# EAGLE design interrupt_controller (EAGLE 5.11)
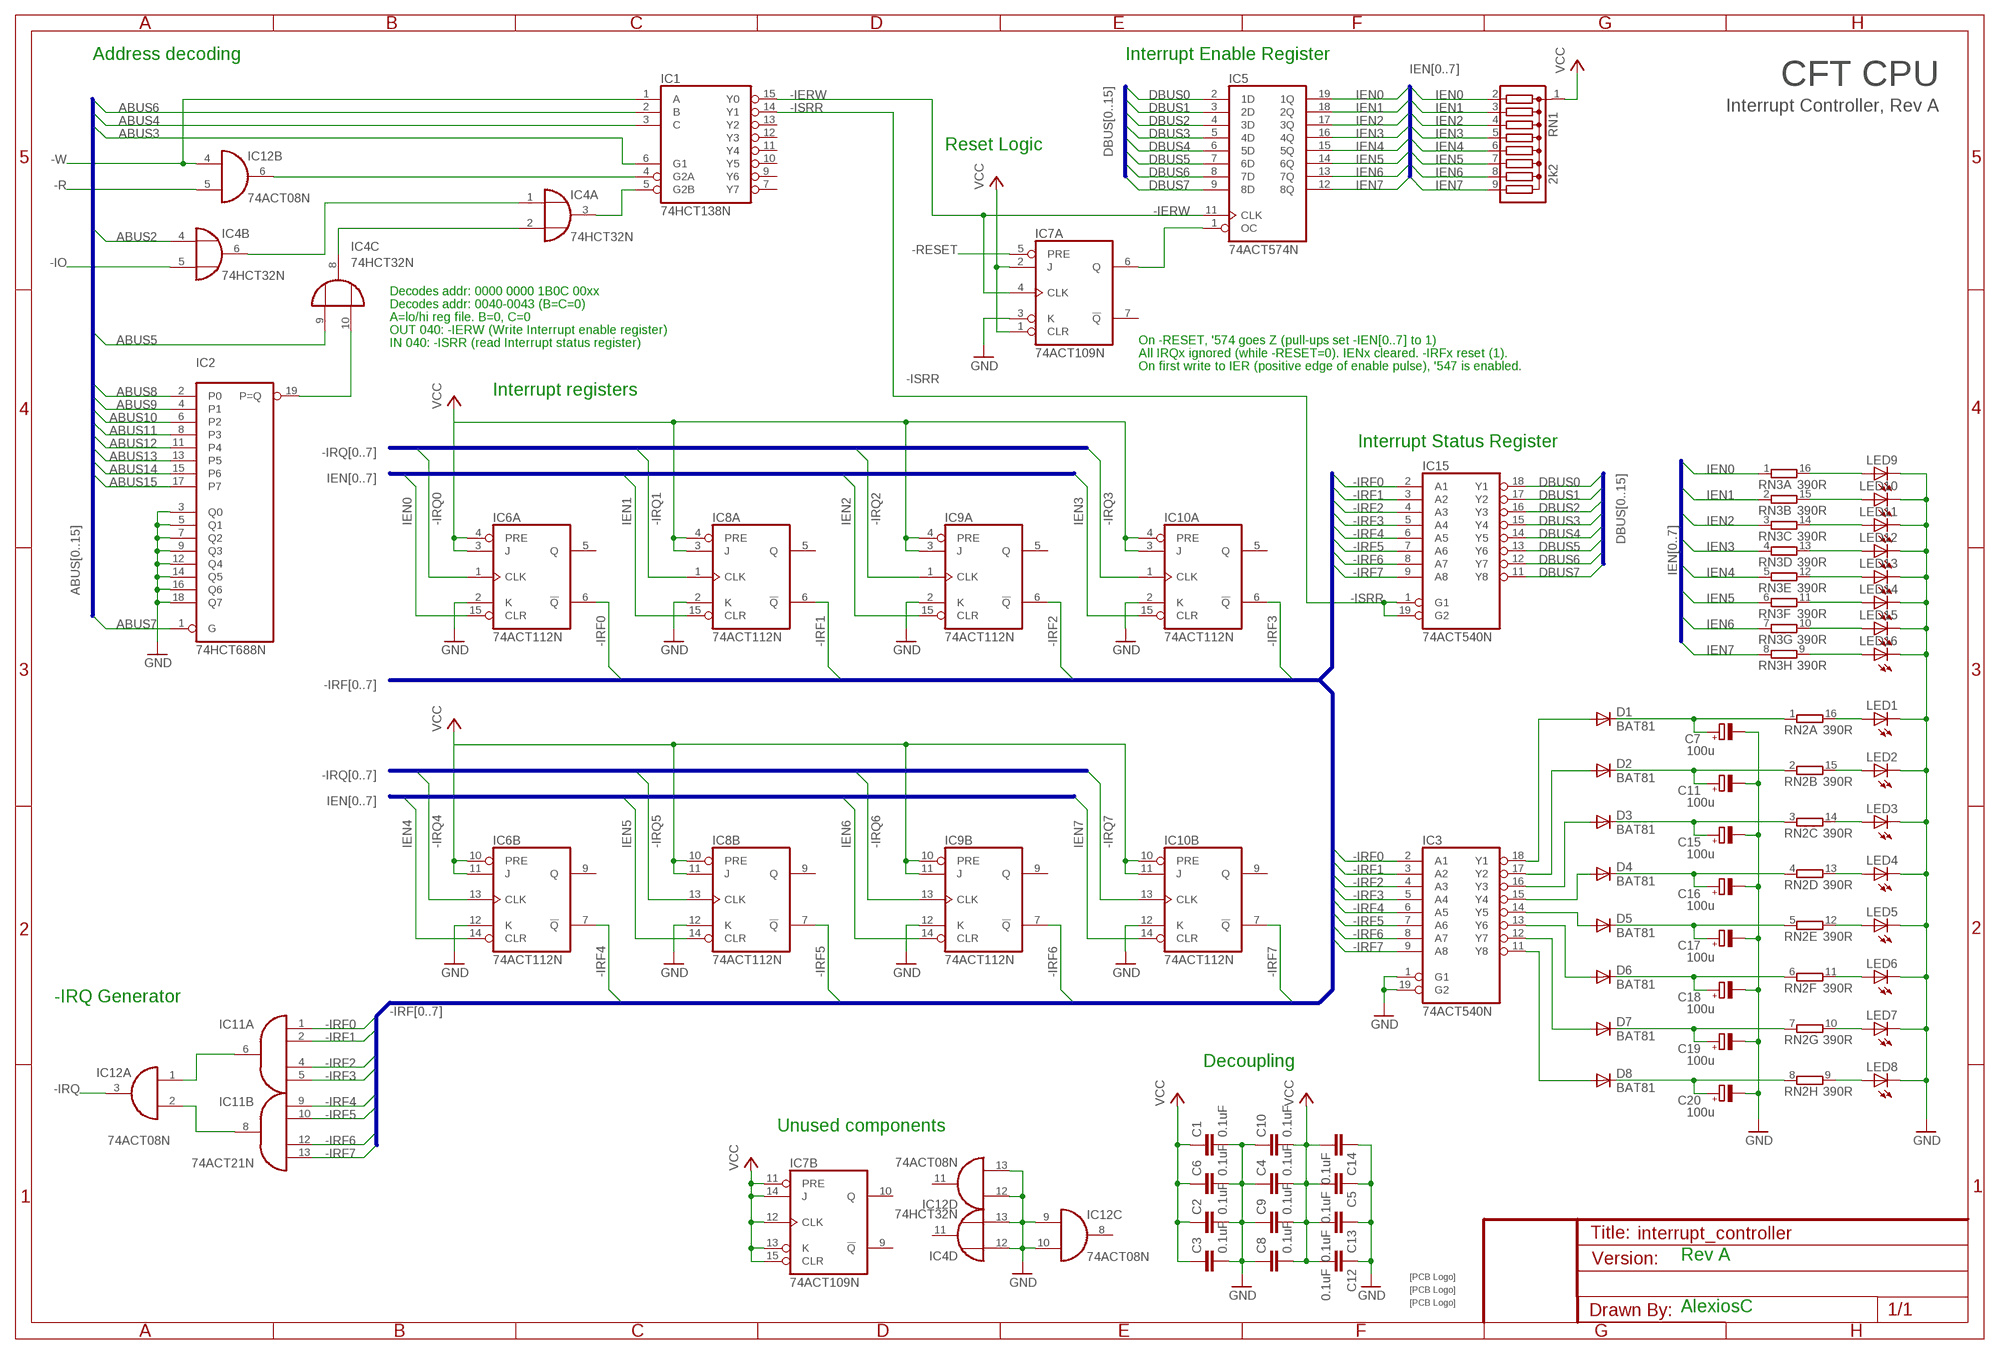
[diagram p0: schematic, sheet 1]

## Parts
C1  0.1uF  C-EU025-025X050  [C025-025X050]
C2  0.1uF  C-EU025-025X050  [C025-025X050]
C3  0.1uF  C-EU025-025X050  [C025-025X050]
C4  0.1uF  C-EU025-025X050  [C025-025X050]
C5  0.1uF  C-EU025-025X050  [C025-025X050]
C6  0.1uF  C-EU025-025X050  [C025-025X050]
C7  100u  CPOL-EUE1.8-4  [E1,8-4]
C8  0.1uF  C-EU025-025X050  [C025-025X050]
C9  0.1uF  C-EU025-025X050  [C025-025X050]
C10  0.1uF  C-EU025-025X050  [C025-025X050]
C11  100u  CPOL-EUE1.8-4  [E1,8-4]
C12  0.1uF  C-EU025-025X050  [C025-025X050]
C13  0.1uF  C-EU025-025X050  [C025-025X050]
C14  0.1uF  C-EU025-025X050  [C025-025X050]
C15  100u  CPOL-EUE1.8-4  [E1,8-4]
C16  100u  CPOL-EUE1.8-4  [E1,8-4]
C17  100u  CPOL-EUE1.8-4  [E1,8-4]
C18  100u  CPOL-EUE1.8-4  [E1,8-4]
C19  100u  CPOL-EUE1.8-4  [E1,8-4]
C20  100u  CPOL-EUE1.8-4  [E1,8-4]
D1  BAT81  [DO34-7]
D2  BAT81  [DO34-7]
D3  BAT81  [DO34-7]
D4  BAT81  [DO34-7]
D5  BAT81  [DO34-7]
D6  BAT81  [DO34-7]
D7  BAT81  [DO34-7]
D8  BAT81  [DO34-7]
IC1  74HCT138N  [DIL16]
IC2  74HCT688N  [DIL20]
IC3  74ACT540N  [DIL20]
IC4  74HCT32N  [DIL14]
IC5  74ACT574N  [DIL20]
IC6  74ACT112N  [DIL16]
IC7  74ACT109N  [DIL16]
IC8  74ACT112N  [DIL16]
IC9  74ACT112N  [DIL16]
IC10  74ACT112N  [DIL16]
IC11  74ACT21N  [DIL14]
IC12  74ACT08N  [DIL14]
IC15  74ACT540N  [DIL20]
LED1  LED3MM  [LED3MM]
LED2  LED3MM  [LED3MM]
LED3  LED3MM  [LED3MM]
LED4  LED3MM  [LED3MM]
LED5  LED3MM  [LED3MM]
LED6  LED3MM  [LED3MM]
LED7  LED3MM  [LED3MM]
LED8  LED3MM  [LED3MM]
LED9  LED3MM  [LED3MM]
LED10  LED3MM  [LED3MM]
LED11  LED3MM  [LED3MM]
LED12  LED3MM  [LED3MM]
LED13  LED3MM  [LED3MM]
LED14  LED3MM  [LED3MM]
LED15  LED3MM  [LED3MM]
LED16  LED3MM  [LED3MM]
RN1  2k2  G08R  [SIL9]
RN2  390R  8R-N  [DIL16]
RN3  390R  8R-N  [DIL16]
U$1  SIGNATUREPLANE  [SIGNATURE_PLANE]
U$2  SIGNATUREPLANE  [SIGNATURE_PLANE]
U$3  SIGNATURESILK  [SIGNATURE]

## Nets
-IERW: IC1.15(Y0) IC5.11(CLK) IC7.4(A:CLK)
-IO: IC4.5(B:I1)
-IRF0: IC3.2(A1) IC6.6(A:!Q) IC11.1(A:I0) IC15.2(A1)
-IRF1: IC3.3(A2) IC8.6(A:!Q) IC11.2(A:I1) IC15.3(A2)
-IRF2: IC3.4(A3) IC9.6(A:!Q) IC11.4(A:I2) IC15.4(A3)
-IRF3: IC3.5(A4) IC10.6(A:!Q) IC11.5(A:I3) IC15.5(A4)
-IRF4: IC3.6(A5) IC6.7(B:!Q) IC11.9(B:I0) IC15.6(A5)
-IRF5: IC3.7(A6) IC8.7(B:!Q) IC11.10(B:I1) IC15.7(A6)
-IRF6: IC3.8(A7) IC9.7(B:!Q) IC11.12(B:I2) IC15.8(A7)
-IRF7: IC3.9(A8) IC10.7(B:!Q) IC11.13(B:I3) IC15.9(A8)
-IRQ: IC12.3(A:O)
-IRQ0: IC6.1(A:CLK)
-IRQ1: IC8.1(A:CLK)
-IRQ2: IC9.1(A:CLK)
-IRQ3: IC10.1(A:CLK)
-IRQ4: IC6.13(B:CLK)
-IRQ5: IC8.13(B:CLK)
-IRQ6: IC9.13(B:CLK)
-IRQ7: IC10.13(B:CLK)
-ISRR: IC1.14(Y1) IC15.1(G1) IC15.19(G2)
-R: IC12.5(B:I1)
-RESET: IC7.5(A:PRE)
-W: IC1.1(A) IC12.4(B:I0)
ABUS2: IC4.4(B:I0)
ABUS3: IC1.6(G1)
ABUS4: IC1.3(C)
ABUS5: IC4.9(C:I0)
ABUS6: IC1.2(B)
ABUS7: IC2.1(G)
ABUS8: IC2.2(P0)
ABUS9: IC2.4(P1)
ABUS10: IC2.6(P2)
ABUS11: IC2.8(P3)
ABUS12: IC2.11(P4)
ABUS13: IC2.13(P5)
ABUS14: IC2.15(P6)
ABUS15: IC2.17(P7)
DBUS0: IC5.2(1D) IC15.18(Y1)
DBUS1: IC5.3(2D) IC15.17(Y2)
DBUS2: IC5.4(3D) IC15.16(Y3)
DBUS3: IC5.5(4D) IC15.15(Y4)
DBUS4: IC5.6(5D) IC15.14(Y5)
DBUS5: IC5.7(6D) IC15.13(Y6)
DBUS6: IC5.8(7D) IC15.12(Y7)
DBUS7: IC5.9(8D) IC15.11(Y8)
GND: C1.2 C2.2 C3.2 C4.1 C5.1 C6.2 C7.- C8.1 C9.1 C10.1 C11.- C12.1 C13.1 C14.1 C15.- C16.- C17.- C18.- C19.- C20.- IC2.3(Q0) IC2.5(Q1) IC2.7(Q2) IC2.9(Q3) IC2.12(Q4) IC2.14(Q5) IC2.16(Q6) IC2.18(Q7) IC3.1(G1) IC3.19(G2) IC4.12(D:I0) IC4.13(D:I1) IC6.2(A:K) IC6.12(B:K) IC7.3(A:K) IC8.2(A:K) IC8.12(B:K) IC9.2(A:K) IC9.12(B:K) IC10.2(A:K) IC10.12(B:K) IC12.9(C:I0) IC12.10(C:I1) IC12.12(D:I0) IC12.13(D:I1) LED1.K(C) LED2.K(C) LED3.K(C) LED4.K(C) LED5.K(C) LED6.K(C) LED7.K(C) LED8.K(C) LED9.K(C) LED10.K(C) LED11.K(C) LED12.K(C) LED13.K(C) LED14.K(C) LED15.K(C) LED16.K(C)
IEN0: IC5.19(1Q) IC6.15(A:CLR) RN1.2 RN3.1
IEN1: IC5.18(2Q) IC8.15(A:CLR) RN1.3 RN3.2
IEN2: IC5.17(3Q) IC9.15(A:CLR) RN1.4 RN3.3
IEN3: IC5.16(4Q) IC10.15(A:CLR) RN1.5 RN3.4
IEN4: IC5.15(5Q) IC6.14(B:CLR) RN1.6 RN3.5
IEN5: IC5.14(6Q) IC8.14(B:CLR) RN1.7 RN3.6
IEN6: IC5.13(7Q) IC9.14(B:CLR) RN1.8 RN3.7
IEN7: IC5.12(8Q) IC10.14(B:CLR) RN1.9 RN3.8
N$1: IC4.2(A:I1) IC4.8(C:O)
N$2: IC11.6(A:O) IC12.1(A:I0)
N$3: IC11.8(B:O) IC12.2(A:I1)
N$5: IC1.4(G2A) IC12.6(B:O)
N$6: IC2.19(P=Q) IC4.10(C:I1)
N$7: IC5.1(OC) IC7.6(A:Q)
N$8: IC4.1(A:I0) IC4.6(B:O)
N$9: D1.A IC3.18(Y1)
N$10: D2.A IC3.17(Y2)
N$11: D3.A IC3.16(Y3)
N$12: IC1.5(G2B) IC4.3(A:O)
N$13: D4.A IC3.15(Y4)
N$14: D5.A IC3.14(Y5)
N$15: D6.A IC3.13(Y6)
N$16: D7.A IC3.12(Y7)
N$17: D8.A IC3.11(Y8)
N$18: C7.+ D1.C RN2.1
N$19: C11.+ D2.C RN2.2
N$20: C15.+ D3.C RN2.3
N$21: C16.+ D4.C RN2.4
N$22: C17.+ D5.C RN2.5
N$23: C18.+ D6.C RN2.6
N$24: C19.+ D7.C RN2.7
N$25: C20.+ D8.C RN2.8
N$26: LED1.A RN2.16
N$27: LED2.A RN2.15
N$28: LED3.A RN2.14
N$29: LED4.A RN2.13
N$30: LED5.A RN2.12
N$31: LED6.A RN2.11
N$32: LED7.A RN2.10
N$33: LED8.A RN2.9
N$34: LED9.A RN3.16
N$35: LED10.A RN3.15
N$36: LED11.A RN3.14
N$37: LED12.A RN3.13
N$38: LED13.A RN3.12
N$39: LED14.A RN3.11
N$40: LED15.A RN3.10
N$41: LED16.A RN3.9
VCC: C1.1 C2.1 C3.1 C4.2 C5.2 C6.1 C8.2 C9.2 C10.2 C12.2 C13.2 C14.2 IC6.3(A:J) IC6.4(A:PRE) IC6.10(B:PRE) IC6.11(B:J) IC7.1(A:CLR) IC7.2(A:J) IC7.11(B:PRE) IC7.12(B:CLK) IC7.13(B:K) IC7.14(B:J) IC7.15(B:CLR) IC8.3(A:J) IC8.4(A:PRE) IC8.10(B:PRE) IC8.11(B:J) IC9.3(A:J) IC9.4(A:PRE) IC9.10(B:PRE) IC9.11(B:J) IC10.3(A:J) IC10.4(A:PRE) IC10.10(B:PRE) IC10.11(B:J) RN1.1
Unconnected: IC1.7(Y7) IC1.9(Y6) IC1.10(Y5) IC1.11(Y4) IC1.12(Y3) IC1.13(Y2) IC4.11(D:O) IC6.5(A:Q) IC6.9(B:Q) IC7.7(A:!Q) IC7.9(B:!Q) IC7.10(B:Q) IC8.5(A:Q) IC8.9(B:Q) IC9.5(A:Q) IC9.9(B:Q) IC10.5(A:Q) IC10.9(B:Q) IC12.8(C:O) IC12.11(D:O)

## Buses
ABUS[0..15]
DBUS[0..15]
IEN[0..7]
-IRQ[0..7]
-IRF[0..7]

## Notes on the sheet
- Address decoding | Interrupt Enable Register
- CFT CPU
- Interrupt Controller, Rev A
- Reset Logic
- Decodes addr: 0000 0000 1B0C 00xx
- Decodes addr: 0040-0043 (B=C=0)
- A=lo/hi reg file. B=0, C=0
- OUT 040: -IERW (Write Interrupt enable register)
- IN 040: -ISRR (read Interrupt status register) | On -RESET, '574 goes Z (pull-ups set -IEN[0..7] to 1)
- All IRQx ignored (while -RESET=0). IENx cleared. -IRFx reset (1).
- On first write to IER (positive edge of enable pulse), '547 is enabled.
- Interrupt registers
- Interrupt Status Register
- -IRQ Generator
- Decoupling
- Unused components
- Rev A
- AlexiosC

## Power pins joined to a net without a drawn wire
GND: IC1.8(GND) IC2.10(GND) IC3.10(GND) IC4.7(P:GND) IC5.10(GND) IC6.8(P:GND) IC7.8(P:GND) IC8.8(P:GND) IC9.8(P:GND) IC10.8(P:GND) IC11.7(P:GND) IC12.7(P:GND) IC15.10(GND)
VCC: IC1.16(VCC) IC2.20(VCC) IC3.20(VCC) IC4.14(P:VCC) IC5.20(VCC) IC6.16(P:VCC) IC7.16(P:VCC) IC8.16(P:VCC) IC9.16(P:VCC) IC10.16(P:VCC) IC11.14(P:VCC) IC12.14(P:VCC) IC15.20(VCC)

## Library data of the parts
C1-C6 C8-C10 C12-C14 = rcl:C-EU: CAPACITOR, European symbol
C7 C11 C15-C20 = rcl:CPOL-EU: POLARIZED CAPACITOR, European symbol
D1-D8 = diode:BAT81: DIODE barrier diode
IC1 = 74xx-eu:74*138: 3-line to 8-line DECODER/DEMULTIPLEXER
IC2 = 74xx-eu:74*688: 8-bit MAGNITUDE/IDENTITY COMPARATOR, totem pole
IC3 IC15 = 74xx-eu:74*540: Octal BUFFER and LINE DRIVER, 3-state
IC4 = 74xx-eu:74*32: Quad 2-input OR gate
IC5 = 74xx-eu:74*574: 8-bit D type FLIP FLOP bus driver
IC6 IC8-IC10 = 74xx-eu:74*112: Dual J-K negative edge triggered FLIP FLOP, preset and clear
IC7 = 74xx-eu:74*109: Dual J-K positive edge triggered FLIP FLOP, preset and clear
IC11 = 74xx-eu:74*21: Dual 4-input AND gate
IC12 = 74xx-eu:74*08: Quad 2-input AND gate
LED1-LED16 = led:LED: LED OSRAM: - CHIPLED LG R971, LG N971, LY N971, LG Q971, LY Q971, LO R971, LY R971 LH N974, LH R974 LS Q976, LO Q976, LY Q976 LO Q996 - Hyper CHIPLED LW Q18S LB Q993, LB Q99A, LB R99A - SideLED LS A670, LO A670, LY A670, LG A670, LP A670 LB A673, LV A673, LT A673, LW A673 LH A674 LY A675 LS A676, LA A676, LO A676, LY A676, LW A676 LS A679, LY A679, LG A679 - Hyper Micro SIDELED® LS Y876, LA Y876, LO Y876, LY Y876 LT Y87S - SmartLED LW L88C, LW L88S LB L89C, LB L89S, LG L890 LS L89K, LO L89K, LY L89K LS L896, LA L896, LO L896, LY L896 - TOPLED LS T670, LO T670, LY T670, LG T670, LP T670 LSG T670, LSP T670, LSY T670, LOP T670, LYG T670 LG T671, LOG T671, LSG T671 LB T673, LV T673, LT T673, LW T673 LH T674 LS T676, LA T676, LO T676, LY T676, LB T676, LH T676, LSB T676, LW T676 LB T67C, LV T67C, LT T67C, LS T67K, LO T67K, LY T67K, LW E67C LS E67B, LA E67B, LO E67B, LY E67B, LB E67C, LV E67C, LT E67C LW T67C LS T679, LY T679, LG T679 LS T770, LO T770, LY T770, LG T770, LP T770 LB T773, LV T773, LT T773, LW T773 LH T774 LS E675, LA E675, LY E675, LS T675 LS T776, LA T776, LO T776, LY T776, LB T776 LHGB T686 LT T68C, LB T68C - Hyper Mini TOPLED® LB M676 - Mini TOPLED Santana® LG M470 LS M47K, LO M47K, LY M47K Source: http://www.osram.convergy.de LUXEON: - LUMILED® LXK2-PW12-R00, LXK2-PW12-S00, LXK2-PW14-U00, LXK2-PW14-V00 LXK2-PM12-R00, LXK2-PM12-S00, LXK2-PM14-U00 LXK2-PE12-Q00, LXK2-PE12-R00, LXK2-PE12-S00, LXK2-PE14-T00, LXK2-PE14-U00 LXK2-PB12-K00, LXK2-PB12-L00, LXK2-PB12-M00, LXK2-PB14-N00, LXK2-PB14-P00, LXK2-PB14-Q00 LXK2-PR12-L00, LXK2-PR12-M00, LXK2-PR14-Q00, LXK2-PR14-R00 LXK2-PD12-Q00, LXK2-PD12-R00, LXK2-PD12-S00 LXK2-PH12-R00, LXK2-PH12-S00 LXK2-PL12-P00, LXK2-PL12-Q00, LXK2-PL12-R00 Source: www.luxeon.com KINGBRIGHT: KA-3528ASYC Source: www.kingbright.com
RN1 = resistor-sil:G08R: SIL RESISTOR; OC_FARNELL: unknown; OC_NEWARK: unknown
RN2 RN3 = resistor-dil:8R-N: DIL RESISTOR; OC_FARNELL: unknown; OC_NEWARK: unknown
U$1-U$3 = alexios:SIGNATURE: Soup signature

## Net classes
0 default: width 0.406 mm, clearance 0.305 mm
1 Decoupling: width 1.27 mm

## Board
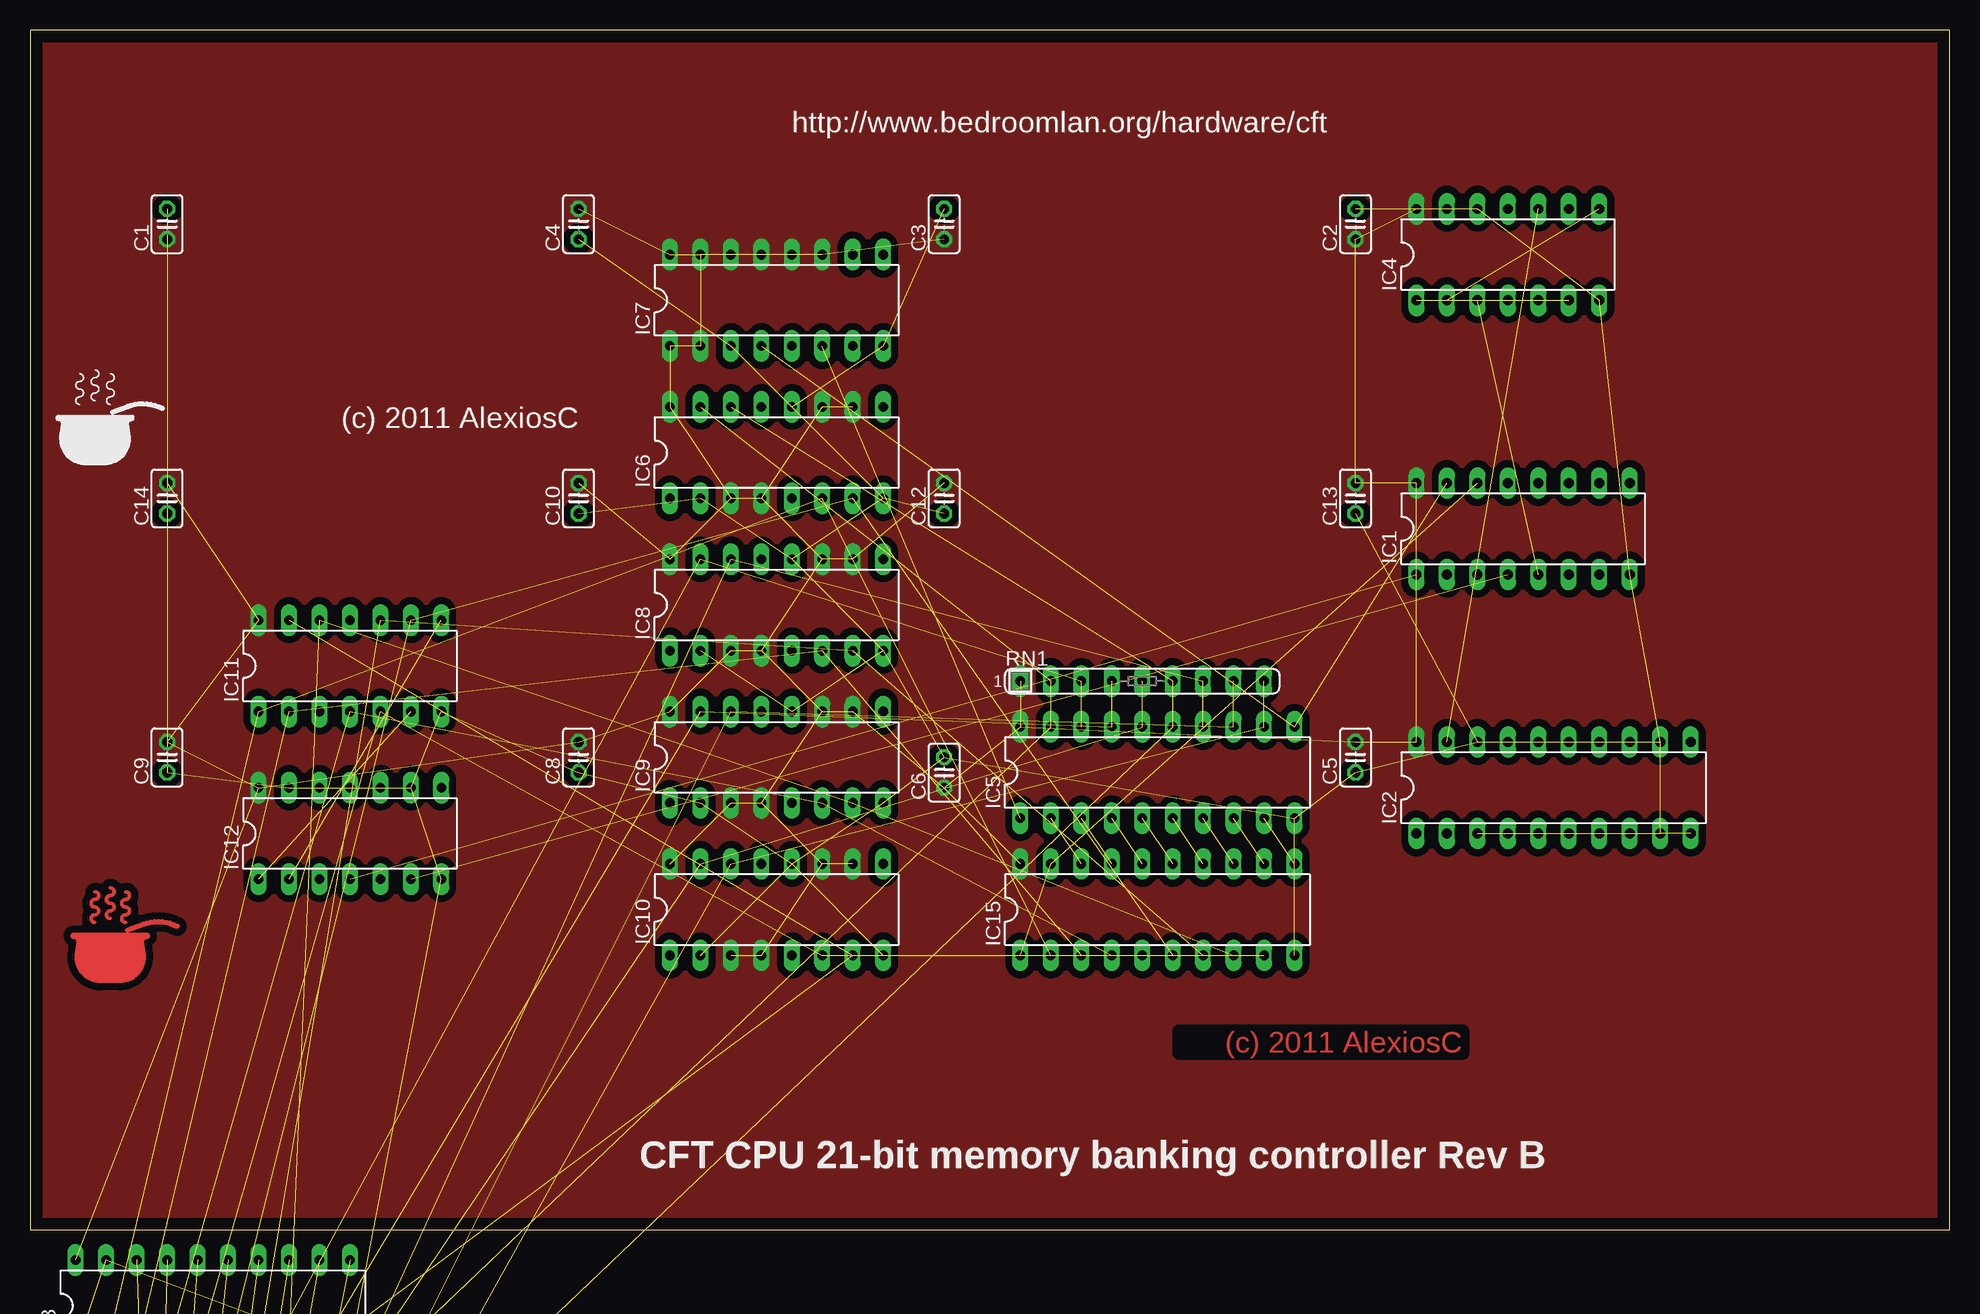
[diagram p1: board, top side]
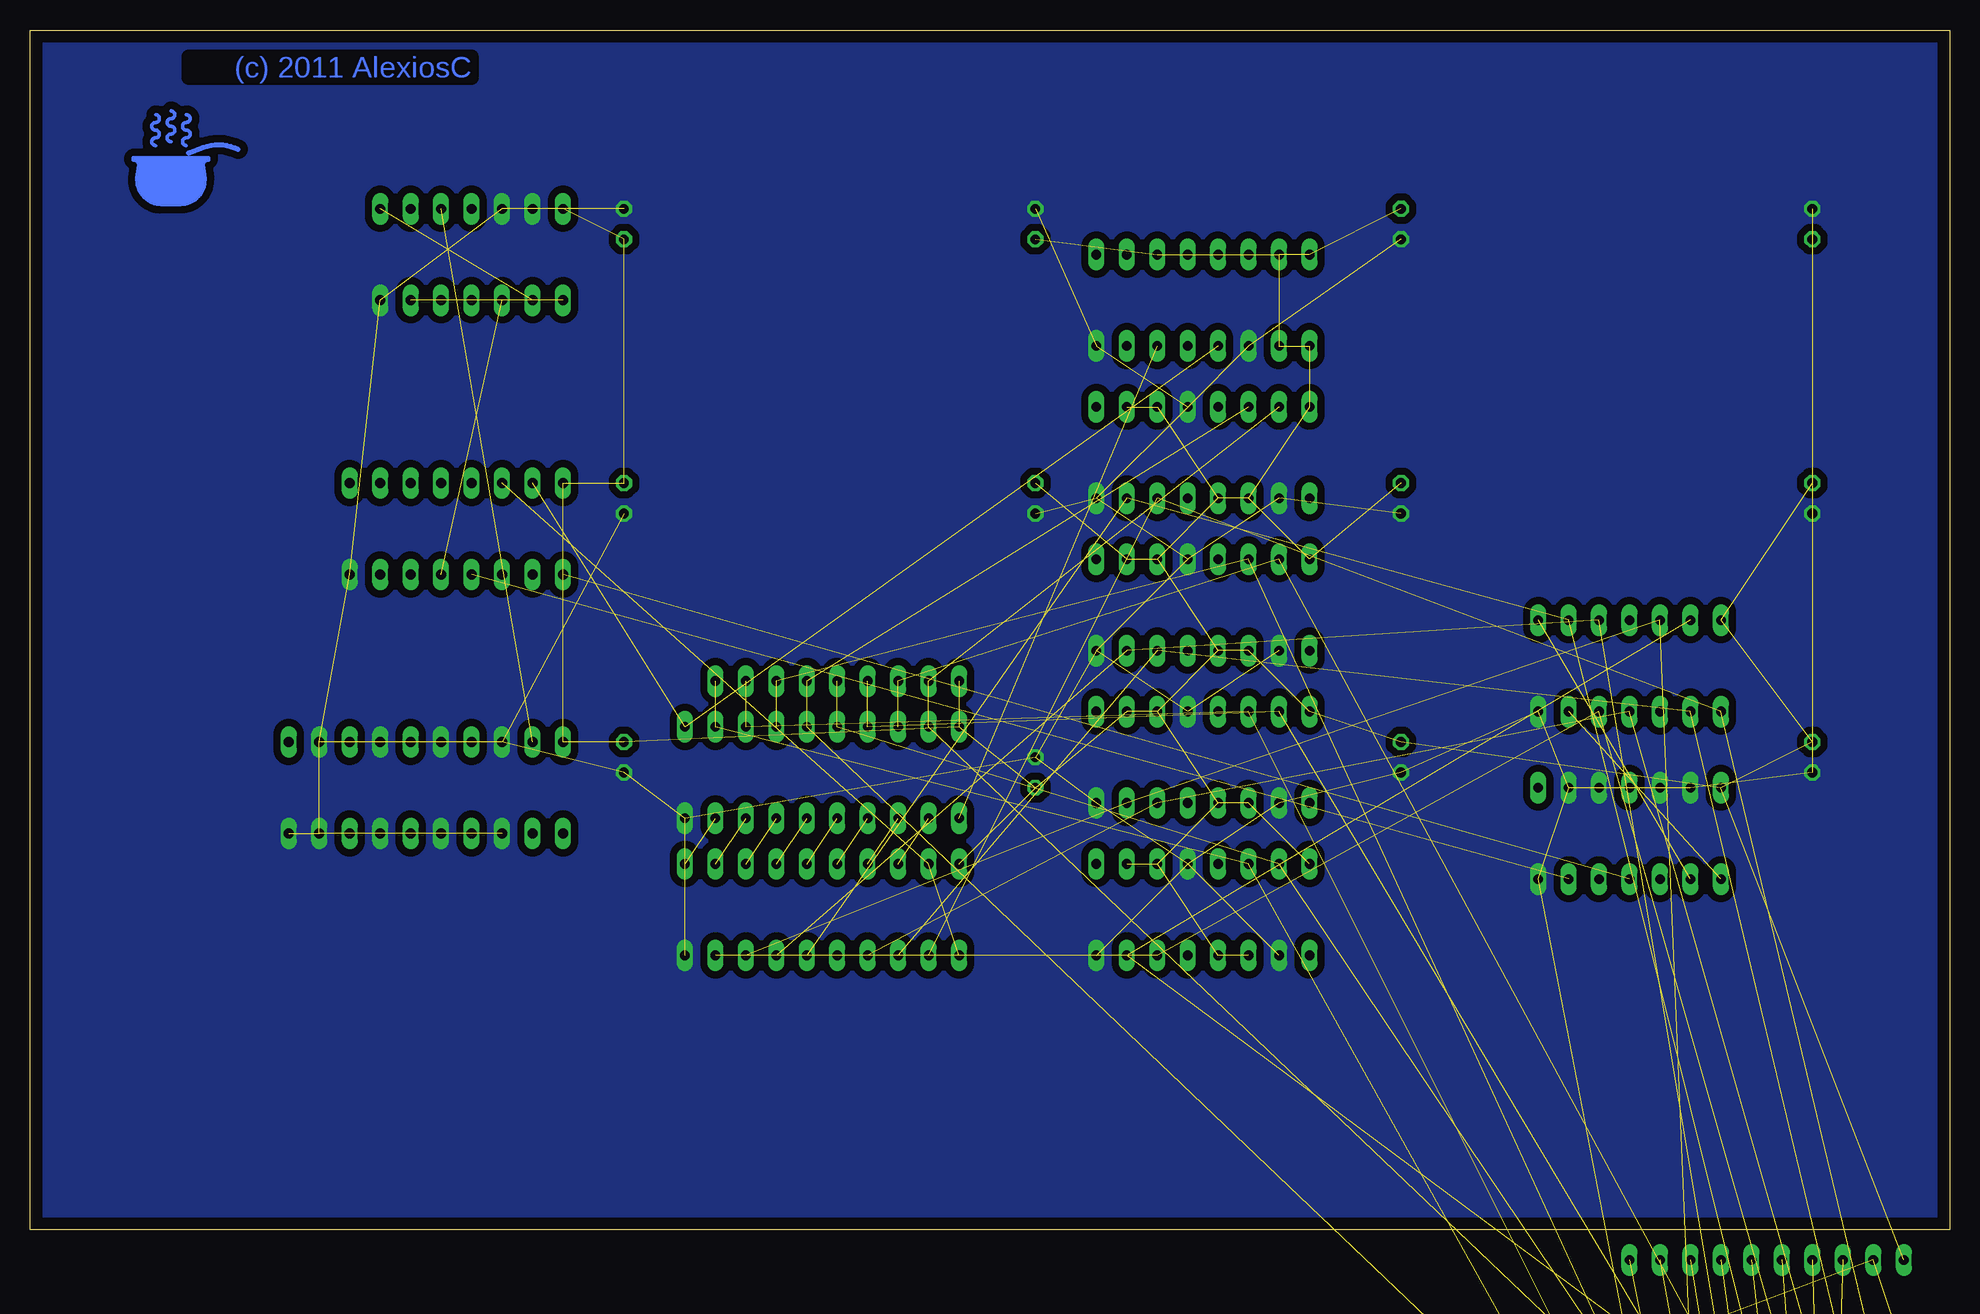
[diagram p2: board, bottom side, seen from below]

Size 160 x 100 mm. Coordinates in mm from the lower left corner, seen from the top.
Outline: 0,0 160,0 160,100 0,100 0,0
Copper layers (1*16): Top 0.035mm / dielectric 1.5mm / Bottom 0.035mm
Design rules "olimex-10mil": minimum track width 10mil, minimum drill 24mil, track to track 10mil, track to pad 10mil, pad to pad 10mil, via to via 10mil, smd to smd 10mil, copper to edge 40mil, drill to drill 10mil, minimum pad ring 10mil, minimum via ring 8mil, stop-mask expansion 0mil, vias tented up to drill 0mil, thermal gap 10mil

### Footprints (pad centres in the part's own frame; a part is rotated, then mirrored left to right if it is on the bottom)
C025-025X050 = drill 0.813 octagon: 1 -1.27,0; 2 1.27,0
E1,8-4 = drill 0.711 pad 1.168 round: + -0.889,0 | drill 0.711 pad 1.168 octagon: - 0.889,0
DO34-7 = drill 0.813 long: A 3.81,0; C -3.81,0
DIL16 = drill 0.813 long: 1 -8.89,-3.81; 2 -6.35,-3.81; 3 -3.81,-3.81; 4 -1.27,-3.81; 5 1.27,-3.81; 6 3.81,-3.81; 7 6.35,-3.81; 8 8.89,-3.81; 9 8.89,3.81; 10 6.35,3.81; 11 3.81,3.81; 12 1.27,3.81; 13 -1.27,3.81; 14 -3.81,3.81; 15 -6.35,3.81; 16 -8.89,3.81
DIL20 = drill 0.813 long: 1 -11.43,-3.81; 2 -8.89,-3.81; 3 -6.35,-3.81; 4 -3.81,-3.81; 5 -1.27,-3.81; 6 1.27,-3.81; 7 3.81,-3.81; 8 6.35,-3.81; 9 8.89,-3.81; 10 11.43,-3.81; 11 11.43,3.81; 12 8.89,3.81; 13 6.35,3.81; 14 3.81,3.81; 15 1.27,3.81; 16 -1.27,3.81; 17 -3.81,3.81; 18 -6.35,3.81; 19 -8.89,3.81; 20 -11.43,3.81
DIL14 = drill 0.813 long: 1 -7.62,-3.81; 2 -5.08,-3.81; 3 -2.54,-3.81; 4 0,-3.81; 5 2.54,-3.81; 6 5.08,-3.81; 7 7.62,-3.81; 8 7.62,3.81; 9 5.08,3.81; 10 2.54,3.81; 11 0,3.81; 12 -2.54,3.81; 13 -5.08,3.81; 14 -7.62,3.81
LED3MM = drill 0.813 octagon: A -1.27,0; K 1.27,0
SIL9 = drill 0.813 long: 1 -10.16,0; 2 -7.62,0; 3 -5.08,0; 4 -2.54,0; 5 0,0; 6 2.54,0; 7 5.08,0; 8 7.62,0; 9 10.16,0

### Placement (x,y rotation side)
C1  11.43,83.82 90 top
C2  110.49,83.82 90 top
C3  76.2,83.82 90 top
C4  45.72,83.82 90 top
C5  110.49,39.37 90 top
C6  76.2,38.1 90 top
C7  2.54,-92.71 0 top  (outside the outline)
C8  45.72,39.37 90 top
C9  11.43,39.37 90 top
C10  45.72,60.96 90 top
C11  2.54,-97.79 0 top  (outside the outline)
C12  76.2,60.96 90 top
C13  110.49,60.96 90 top
C14  11.43,60.96 90 top
C15  2.54,-102.87 0 top  (outside the outline)
C16  2.54,-107.95 0 top  (outside the outline)
C17  2.54,-113.03 0 top  (outside the outline)
C18  2.54,-118.11 0 top  (outside the outline)
C19  2.54,-123.19 0 top  (outside the outline)
C20  2.54,-128.27 0 top  (outside the outline)
D1  6.35,-41.91 0 top  (outside the outline)
D2  6.35,-48.26 0 top  (outside the outline)
D3  6.35,-54.61 0 top  (outside the outline)
D4  6.35,-60.96 0 top  (outside the outline)
D5  6.35,-67.31 0 top  (outside the outline)
D6  6.35,-73.66 0 top  (outside the outline)
D7  6.35,-80.01 0 top  (outside the outline)
D8  6.35,-86.36 0 top  (outside the outline)
IC1  124.46,58.42 0 top
IC2  127,36.83 0 top
IC3  15.24,-6.35 0 top
IC4  123.19,81.28 0 top
IC5  93.98,38.1 0 top
IC6  62.23,64.77 0 top
IC7  62.23,77.47 0 top
IC8  62.23,52.07 0 top
IC9  62.23,39.37 0 top
IC10  62.23,26.67 0 top
IC11  26.67,46.99 0 top
IC12  26.67,33.02 0 top
IC15  93.98,26.67 0 top
LED1  2.54,-133.35 0 top  (outside the outline)
LED2  2.54,-138.43 0 top  (outside the outline)
LED3  2.54,-143.51 0 top  (outside the outline)
LED4  2.54,-148.59 0 top  (outside the outline)
LED5  2.54,-153.67 0 top  (outside the outline)
LED6  2.54,-158.75 0 top  (outside the outline)
LED7  2.54,-163.83 0 top  (outside the outline)
LED8  2.54,-168.91 0 top  (outside the outline)
LED9  2.54,-173.99 0 top  (outside the outline)
LED10  2.54,-179.07 0 top  (outside the outline)
LED11  2.54,-184.15 0 top  (outside the outline)
LED12  2.54,-189.23 0 top  (outside the outline)
LED13  2.54,-194.31 0 top  (outside the outline)
LED14  2.54,-199.39 0 top  (outside the outline)
LED15  2.54,-204.47 0 top  (outside the outline)
LED16  2.54,-209.55 0 top  (outside the outline)
RN1  92.71,45.72 0 top
RN2  12.7,-19.05 0 top  (outside the outline)
RN3  12.7,-31.75 0 top  (outside the outline)
U$1  3.81,20.32 0 top
U$2  151.13,85.09 0 bottom
U$3  2.54,63.5 0 top

### Tracks (layer width: path | path; a pad name or v marks a point on that pad's centre or on a via)
-IERW  (2 unrouted)
-IRF0  (3 unrouted)
-IRF1  (3 unrouted)
-IRF2  (3 unrouted)
-IRF3  (3 unrouted)
-IRF4  (3 unrouted)
-IRF5  (3 unrouted)
-IRF6  (3 unrouted)
-IRF7  (3 unrouted)
-ISRR  (2 unrouted)
-W  (1 unrouted)
DBUS0  (1 unrouted)
DBUS1  (1 unrouted)
DBUS2  (1 unrouted)
DBUS3  (1 unrouted)
DBUS4  (1 unrouted)
DBUS5  (1 unrouted)
DBUS6  (1 unrouted)
DBUS7  (1 unrouted)
GND  (73 unrouted)
  pour Bottom (isolate 0.61, no thermals): 0,100.33 0,0 160.02,0 160.02,100.33
IEN0  (3 unrouted)
IEN1  (3 unrouted)
IEN2  (3 unrouted)
IEN3  (3 unrouted)
IEN4  (3 unrouted)
IEN5  (3 unrouted)
IEN6  (3 unrouted)
IEN7  (3 unrouted)
N$1  (1 unrouted)
N$2  (1 unrouted)
N$3  (1 unrouted)
N$5  (1 unrouted)
N$6  (1 unrouted)
N$7  (1 unrouted)
N$8  (1 unrouted)
N$9  (1 unrouted)
N$10  (1 unrouted)
N$11  (1 unrouted)
N$12  (1 unrouted)
N$13  (1 unrouted)
N$14  (1 unrouted)
N$15  (1 unrouted)
N$16  (1 unrouted)
N$17  (1 unrouted)
N$18  (2 unrouted)
N$19  (2 unrouted)
N$20  (2 unrouted)
N$21  (2 unrouted)
N$22  (2 unrouted)
N$23  (2 unrouted)
N$24  (2 unrouted)
N$25  (2 unrouted)
N$26  (1 unrouted)
N$27  (1 unrouted)
N$28  (1 unrouted)
N$29  (1 unrouted)
N$30  (1 unrouted)
N$31  (1 unrouted)
N$32  (1 unrouted)
N$33  (1 unrouted)
N$34  (1 unrouted)
N$35  (1 unrouted)
N$36  (1 unrouted)
N$37  (1 unrouted)
N$38  (1 unrouted)
N$39  (1 unrouted)
N$40  (1 unrouted)
N$41  (1 unrouted)
VCC  (48 unrouted)
  pour Top (isolate 0.61, no thermals): 0,100.33 0,0 160.02,0 160.02,100.33

### Text on the board
Top: (c) 2011 AlexiosC
Bottom: (c) 2011 AlexiosC
tNames: http://www.bedroomlan.org/hardware/cft | (c) 2011 AlexiosC | CFT CPU 21-bit memory banking controller Rev B